# Altium schematic sheet Sheet_FromtPage.SchDoc: R2C2 - RepRapCncController
size A3; CompanyName: bitBOX; DrawnBy: FMendes75@gmail.com; Revision: V1.1P; SheetNumber: 1; SheetTotal: 2; PageSetup: Record=PageOptions|CenterHorizontal=True|CenterVertical=True|PrintScale=1.04|XCorrection=1.00|YCorrection=1.00|PrintKind=1|BorderSize=5000000|LeftOffset=0|BottomOffset=0|Orientation=2|PaperLength=1000|PaperWidth=1000|Scale=100|PaperSource=7|PrintQuality=-4|MediaType=1|DitherType=10|PaperKind=A3|PrintScaleMode=1; license: Creative Commons BY-NC-SA; Site: www.3dprinting-r2c2.com; ProjectName: R2C2 - RepRapCncController
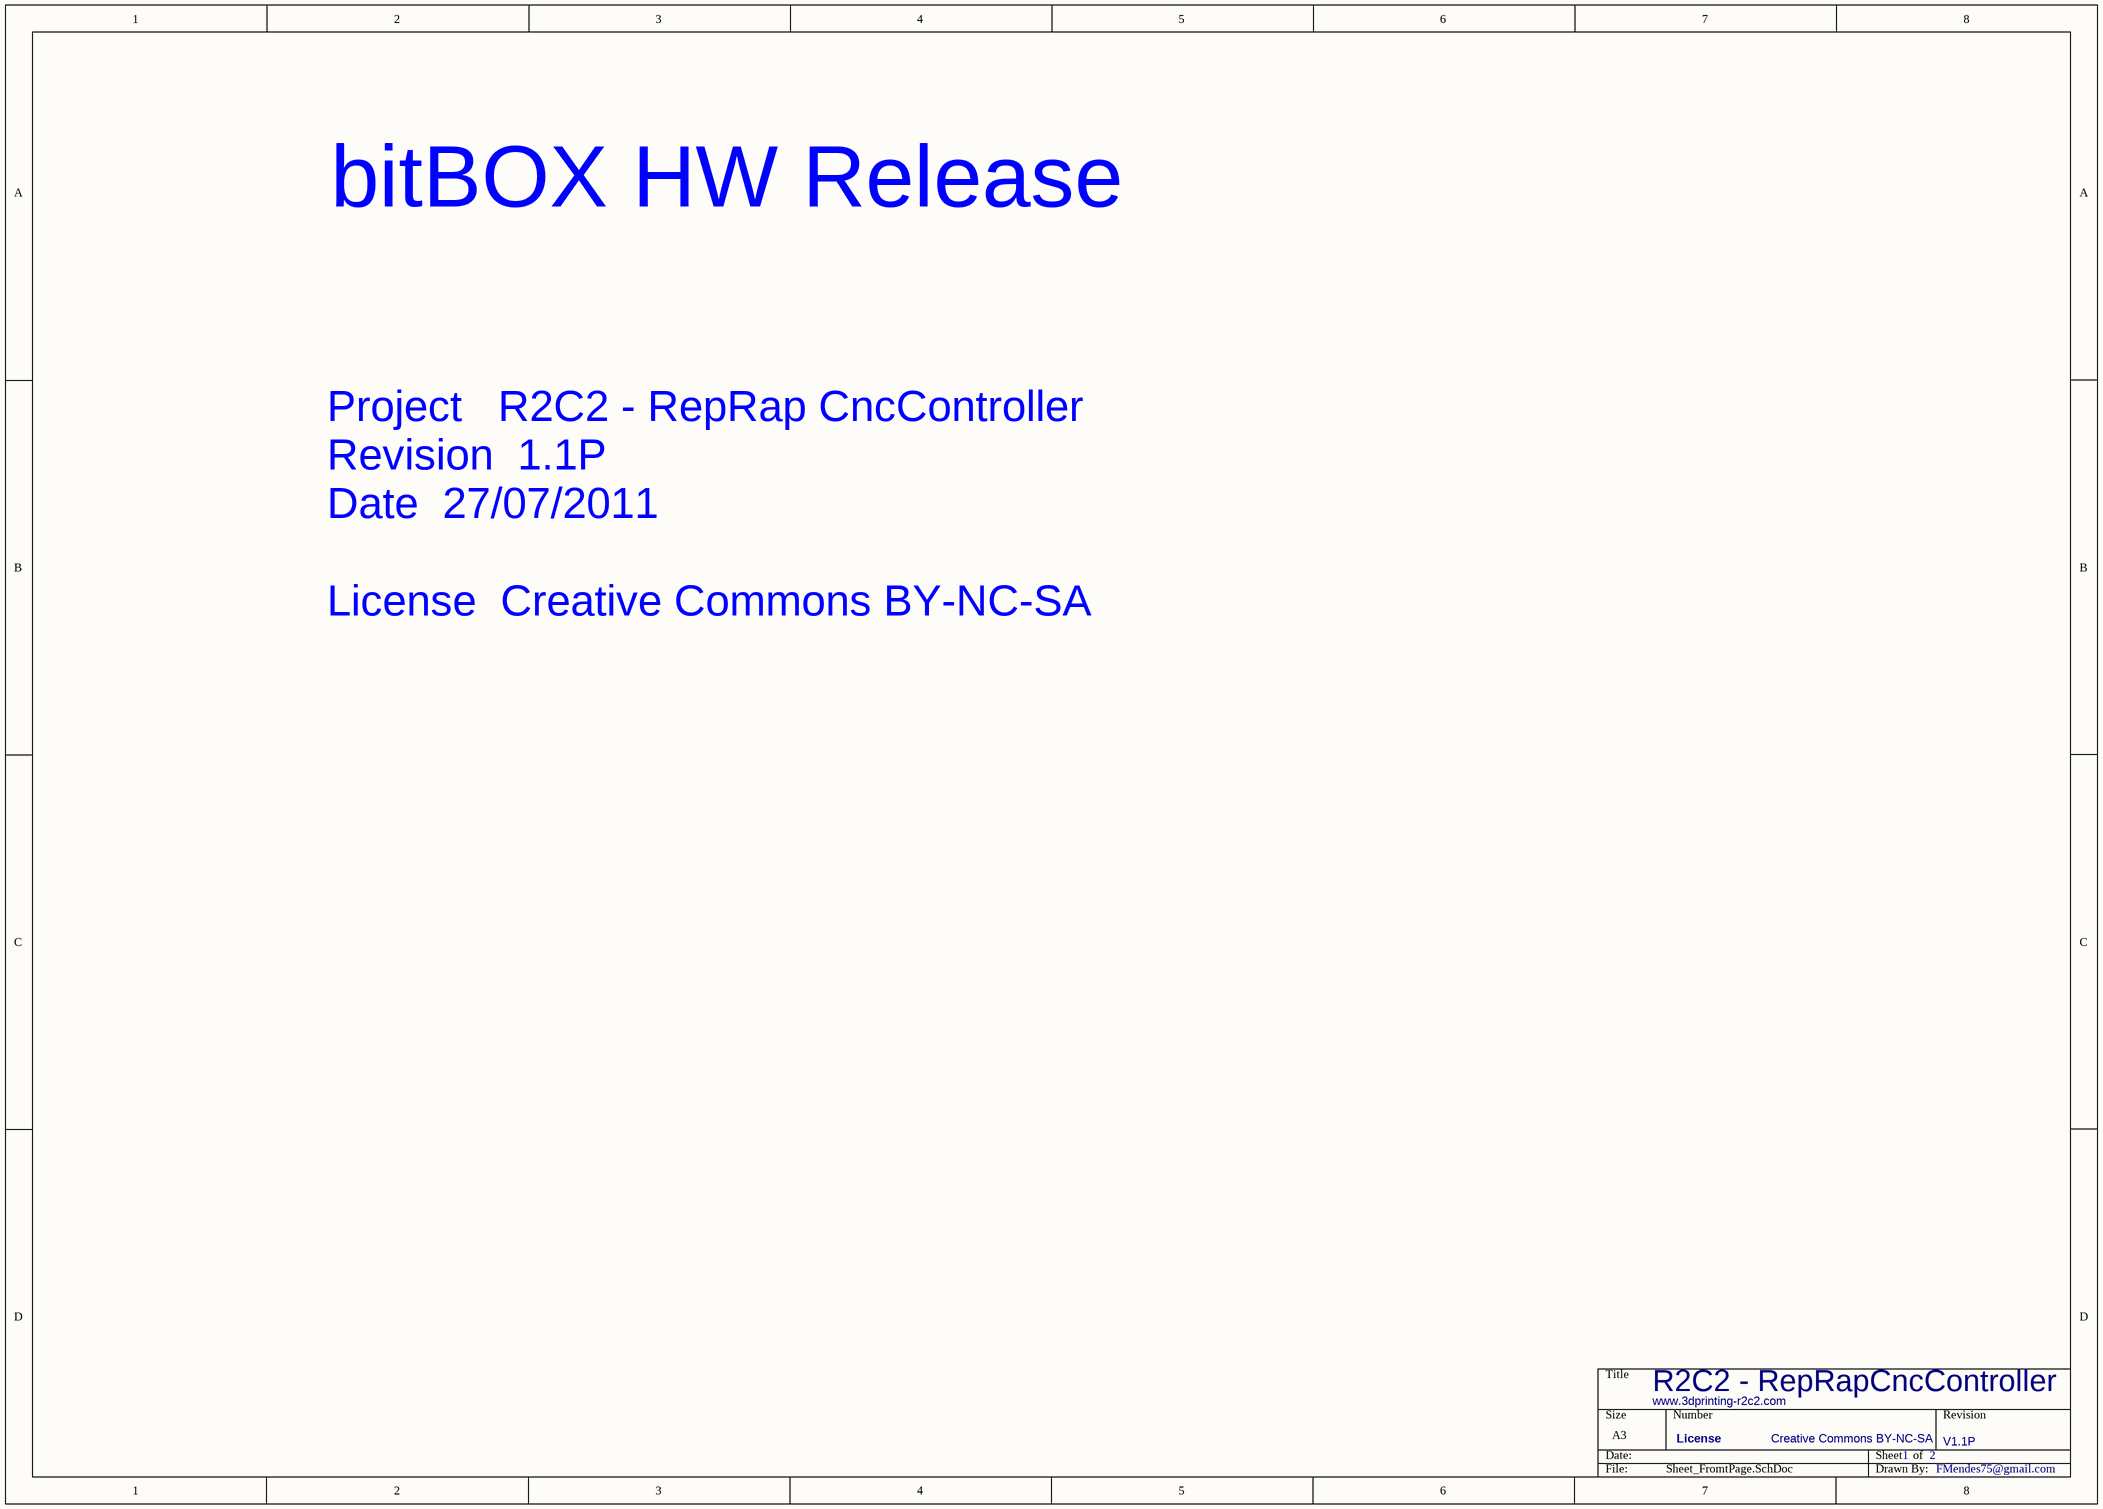
[diagram p0: Sheet_FromtPage.SchDoc]

## Notes on the sheet
- bitBOX HW Release
- Project 		R2C2 - RepRap CncController
  Revision		1.1P
  Date		27/07/2011
  License		Creative Commons BY-NC-SA
- License